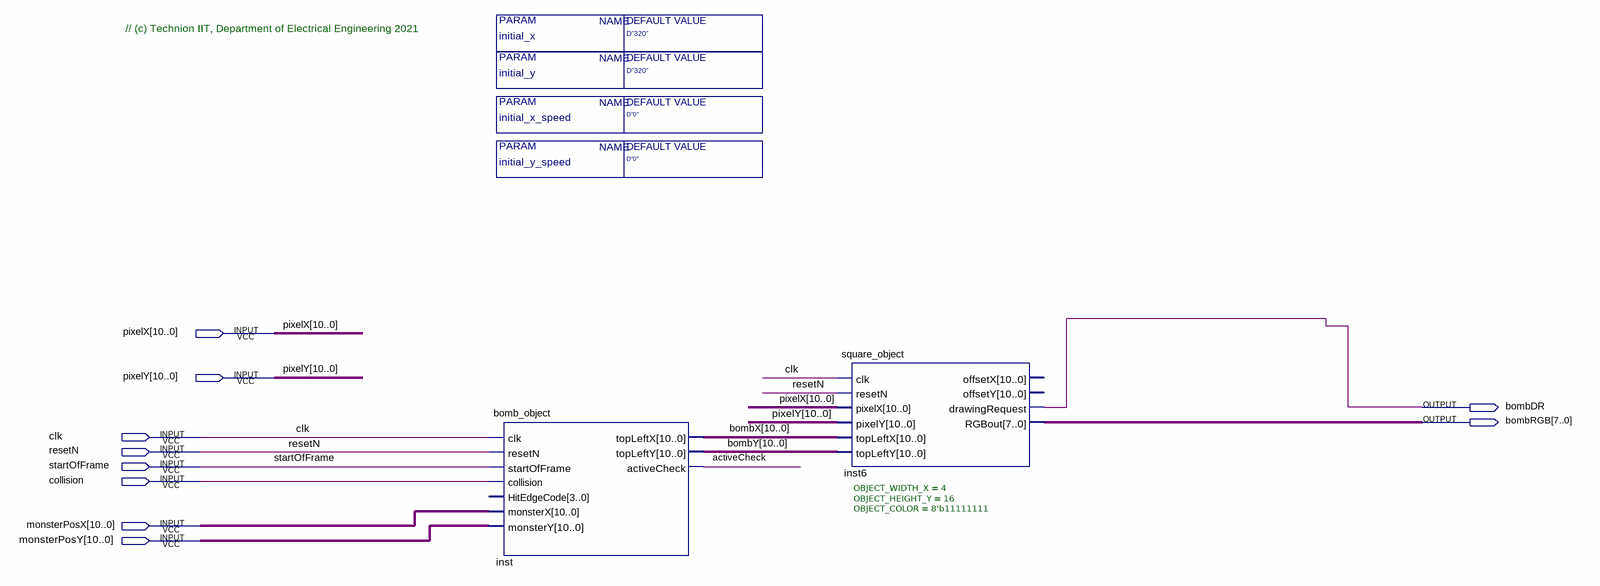
[diagram p0: schematic sheet]
// Quartus schematic Bomb_Block.bdf as structural Verilog: 2 symbols, 10 pins
module Bomb_Block #(parameter initial_x_speed = "D\"0\"", parameter initial_y = "D\"320\"", parameter initial_x = "D\"320\"", parameter initial_y_speed = "D\"0\"") (
  input  [10:0] pixelX,
  input  [10:0] pixelY,
  input  clk,
  input  resetN,
  input  startOfFrame,
  input  collision,
  input  [10:0] monsterPosX,
  input  [10:0] monsterPosY,
  output bombDR,
  output [7:0] bombRGB
);

  wire activeCheck;
  wire [10:0] bombX, bombY;

  bomb_object inst (
    .clk(clk), .resetN(resetN), .startOfFrame(startOfFrame), .collision(collision), .monsterX(monsterPosX),
    .monsterY(monsterPosY), .topLeftX(bombX), .topLeftY(bombY), .activeCheck(activeCheck));  // open: HitEdgeCode
  square_object #(.OBJECT_WIDTH_X(4), .OBJECT_HEIGHT_Y(16), .OBJECT_COLOR(8'b11111111)) inst6 (
    .clk(clk), .resetN(resetN), .pixelX(pixelX), .pixelY(pixelY), .topLeftX(bombX), .topLeftY(bombY),
    .drawingRequest(bombDR), .RGBout(bombRGB));  // open: offsetX, offsetY

  // Notes on the sheet:
  //   // (c) Technion IIT, Department of Electrical Engineering 2021
endmodule
